# Altium schematic sheet SUPPLY.SchDoc
size A4
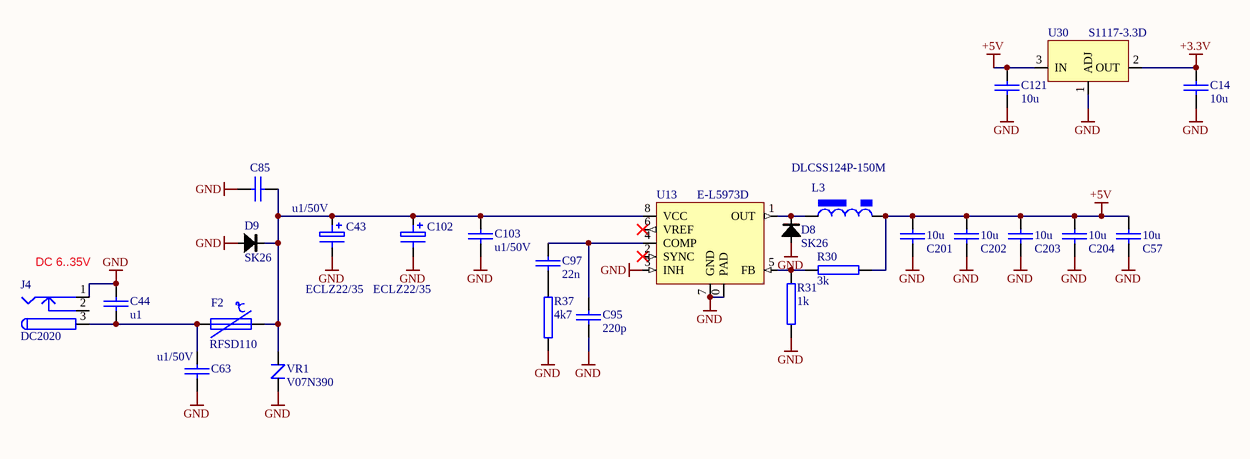
[diagram p0: SUPPLY.SchDoc]

## Parts
C14  10u  [0805]
C43  ECLZ22/35  [CAP_SMT_EL_6.3mm_D]
C44  u1  [0603]
C57  10u  [0805C]
C63  u1/50V  [0805C]
C85  u1/50V  [0805C]
C95  220p  [0603C]
C97  22n  [0603C]
C102  ECLZ22/35  [CAP_SMT_EL_6.3mm_D]
C103  u1/50V  [0805C]
C121  10u  [0805]
C201  10u  [0805C]
C202  10u  [0805C]
C203  10u  [0805C]
C204  10u  [0805C]
D8  SK26  [DO-214AA/SMB]
D9  SK26  [DO-214AA/SMB]
F2  RFSD110  [PTC_SMD_1812]
J4  DC2020  [DC2020]
L3  DLCSS124P-150M  [choke_DLCSS124]
R30  3k  [0603R]
R31  1k  [0603R]
R37  4k7  [0603R]
U13  E-L5973D  [PDSO-8]
U30  S1117-3.3D  [TO-252]
VR1  V07N390  [Varistor_7mm]

## Nets
+3.3V: C14.2 U30.2(OUT)
+5V: C57.1 C121.2 C201.1 C202.1 C203.1 C204.1 L3.2 R30.1 U30.3(IN)
GND: C14.1 C43.2 C44.1 C57.2 C63.2 C85.2 C95.1 C102.2 C103.2 C121.1 C201.2 C202.2 C203.2 C204.2 D8.A D9.A J4.1 R31.2 R37.1 U13.0(PAD) U13.3(INH) U13.7(GND) U30.1(ADJ) VR1.2
NetC43_1: C43.1 C85.1 C102.1 C103.1 D9.K F2.2 U13.8(VCC) VR1.1
NetC44_2: C44.2 C63.1 F2.1 J4.3
NetC95_2: C95.2 C97.2 U13.4(COMP)
NetC97_1: C97.1 R37.2
NetD8_K: D8.K L3.1 U13.1(OUT)
NetR30_2: R30.2 R31.1 U13.5(FB)

Not connected (* = marked no-connect by the designer): J4 2; U13 2(SYNC)* 6(VREF)*

## Notes on the sheet
- DC 6..35V

## Library data of the parts
C14 C44 C57 C63 C85 C95 C97 C103 C121 C201-C204 = CAP_SMD: Capacitor SMD
C43 C102 = CAP_ELECTRO_SMD: Electrolytic Capacitor
D8 D9 = DIODE_SK26: 2A shottky diode (Maritex)
F2 = F_POLYSWITCH: polymer FUSE
J4 = CON_DC_JACK_TH: Low Voltage Power Supply Connector (maritex); Published: 17-Dec-2003; Datasheet: Latest Revision: 09-May-2002; Publisher: Altium Limited
L3 = POWER_INDUCTOR_CSS124: inductor
R30 R31 R37 = RES_SMD: SMD Resistor
U13 = L5973D: 2.5A SWITCH STEP DOWN SWITCHING REGULATOR
U30 = REG_S1117-3.3D: Voltage Regulator
VR1 = Varistor V07N: varistor 7mm (Maritex)